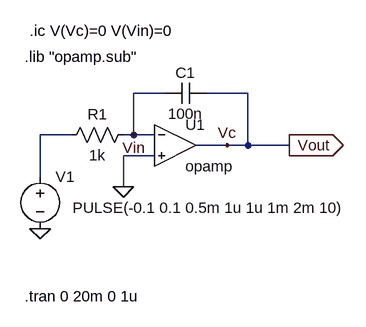
[diagram p0: schematic Draft5.asc]
Draft5.asc, the LTspice schematic file:
Version 4
SHEET 1 880 680
WIRE 224 16 176 16
WIRE 352 16 288 16
WIRE 80 80 32 80
WIRE 176 80 176 16
WIRE 176 80 160 80
WIRE 208 80 176 80
WIRE 320 96 272 96
WIRE 352 96 352 16
WIRE 352 96 320 96
WIRE 416 96 352 96
WIRE 208 112 160 112
WIRE 32 144 32 80
WIRE 160 160 160 112
FLAG 32 224 0
FLAG 416 96 Vout
IOPIN 416 96 Out
FLAG 160 160 0
FLAG 320 96 Vc
FLAG 176 80 Vin
SYMBOL voltage 32 128 R0
WINDOW 123 0 0 Left 0
WINDOW 39 0 0 Left 0
WINDOW 3 50 64 Left 2
SYMATTR InstName V1
SYMATTR Value PULSE(-0.1 0.1 0.5m 1u 1u 1m 2m 10)
SYMBOL res 176 64 R90
WINDOW 0 0 56 VBottom 2
WINDOW 3 32 56 VTop 2
SYMATTR InstName R1
SYMATTR Value 1k
SYMBOL cap 288 0 R90
WINDOW 0 0 32 VBottom 2
WINDOW 3 32 32 VTop 2
SYMATTR InstName C1
SYMATTR Value 100n
SYMBOL OpAmps\\opamp 240 32 R0
SYMATTR InstName U1
TEXT 8 328 Left 2 !.tran 0 20m 0 1u
TEXT 8 -40 Left 2 !.lib "opamp.sub"
TEXT 16 -80 Left 2 !.ic V(Vc)=0 V(Vin)=0

The netlist it stands for:
* Draft5.asc
V1 N001 0 PULSE(-0.1 0.1 0.5m 1u 1u 1m 2m 10)
R1 Vin N001 1k
C1 Vc Vin 100n
XU1 Vin 0 Vc opamp Aol=100K GBW=10Meg  ; pins invin noninvin out
.tran 0 20m 0 1u
.lib "opamp.sub"
.ic V(Vc)=0 V(Vin)=0
.backanno
.end